# EAGLE design db9umt32 (EAGLE 9.0.0)
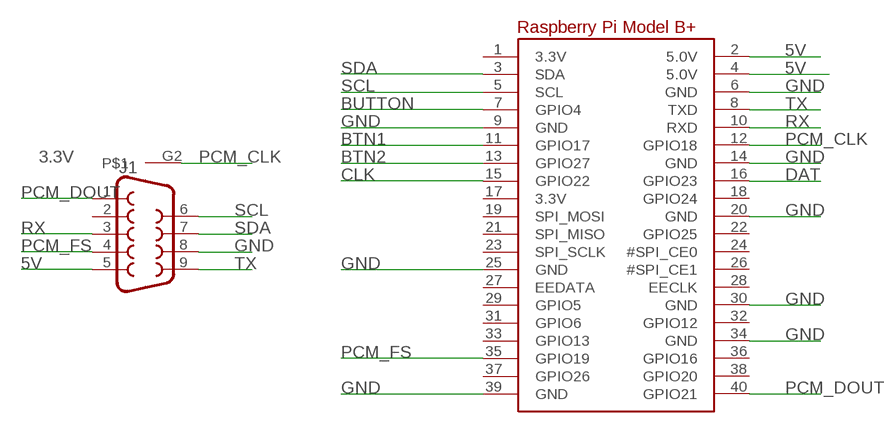
[diagram p0: schematic, sheet 1]

## Parts
J1  SPARKFUN-CONNECTORS_DB9FEMALE  [SPARKFUN-CONNECTORS_DB9]
RPI2  RASPBERRYPI_BPLUS_BONNETNODIM  [PI_BONNET_NODIM]

## Nets
5V: J1.5 RPI2.2(5.0V) RPI2.4(5.0V)
BTN1: RPI2.11(GPIO17)
BTN2: RPI2.13(GPIO27)
BUTTON: RPI2.7(GPIO4)
CLK: RPI2.15(GPIO22)
DAT: RPI2.16(GPIO23)
GND: J1.8 RPI2.6(GND) RPI2.9(GND) RPI2.14(GND) RPI2.20(GND) RPI2.25(GND) RPI2.30(GND) RPI2.34(GND) RPI2.39(GND)
PCM_CLK: J1.G2 RPI2.12(GPIO18)
PCM_DOUT: J1.1 RPI2.40(GPIO21)
PCM_FS: J1.4 RPI2.35(GPIO19)
RX: J1.3 RPI2.10(RXD)
SCL: J1.6 RPI2.5(SCL)
SDA: J1.7 RPI2.3(SDA)
TX: J1.9 RPI2.8(TXD)
Unconnected: J1.2 RPI2.1(3.3V) RPI2.17(3.3V) RPI2.18(GPIO24) RPI2.19(SPI_MOSI) RPI2.21(SPI_MISO) RPI2.22(GPIO25) RPI2.23(SPI_SCLK) RPI2.24(#SPI_CE0) RPI2.26(#SPI_CE1) RPI2.27(EEDATA) RPI2.28(EECLK) RPI2.29(GPIO5) RPI2.31(GPIO6) RPI2.32(GPIO12) RPI2.33(GPIO13) RPI2.36(GPIO16) RPI2.37(GPIO26) RPI2.38(GPIO20)

## Library data of the parts
J1 = db9tg:SPARKFUN-CONNECTORS_DB9: DB9 Connector Standard DB9 (D-Sub 9) serial connector. Can be used for CAN bus as well as RS485 and RS232. Footprint production proven. Here is the female version connector we sell at SparkFun: 9 Pin Female Serial Connector - PCB Mount <https://www.sparkfun.com/products/429> (PRT-00429) This connector has been used on the following SparkFun products: SparkFun RS232 Shifter - SMD <https://www.sparkfun.com/products/449> (PRT-00449) SparkFun RS232 Shifter SMD (No DB9) <https://www.sparkfun.com/products/8780> (PRT-08780); PROD_ID: CONN-08194
RPI2 = microbuilder:RASPBERRYPI_BPLUS

## Net classes
1 GND: width 0.254 mm
2 VCC: width 0.254 mm

## Board
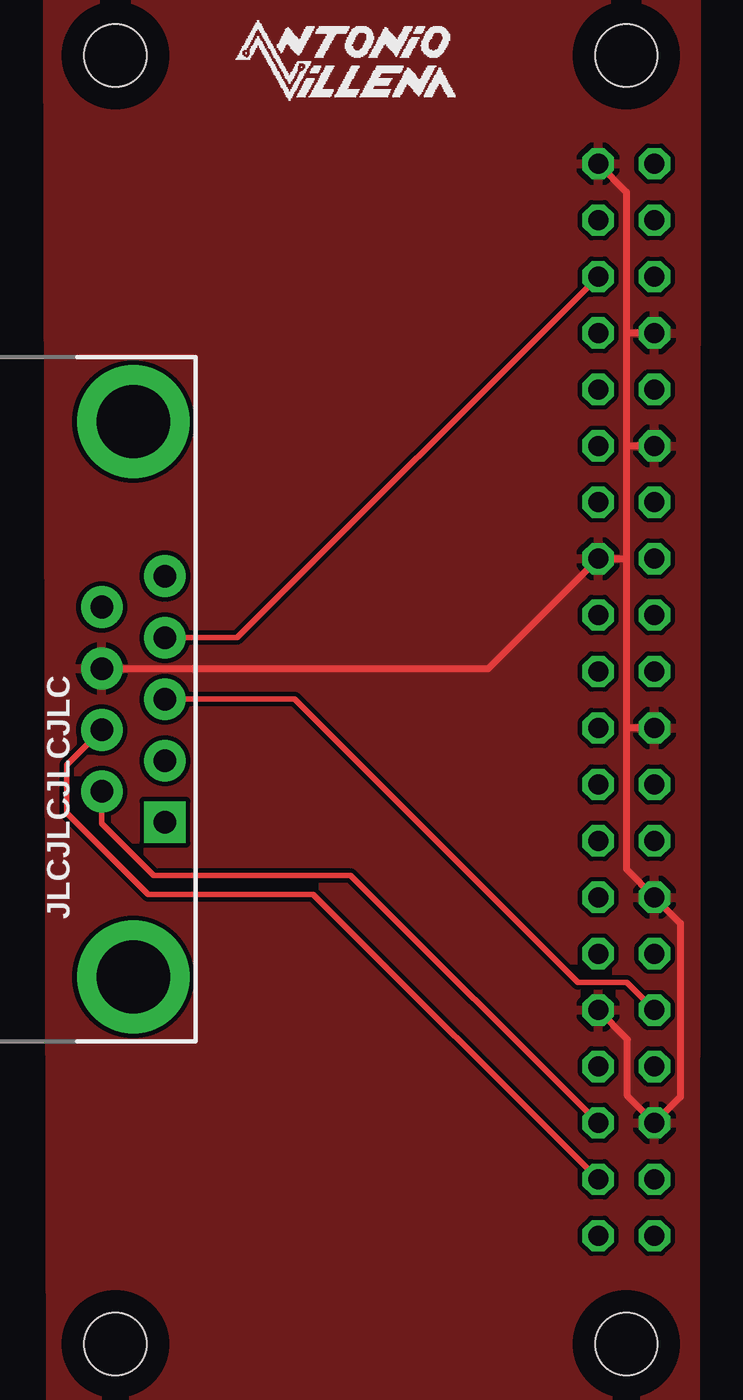
[diagram p1: board, top side]
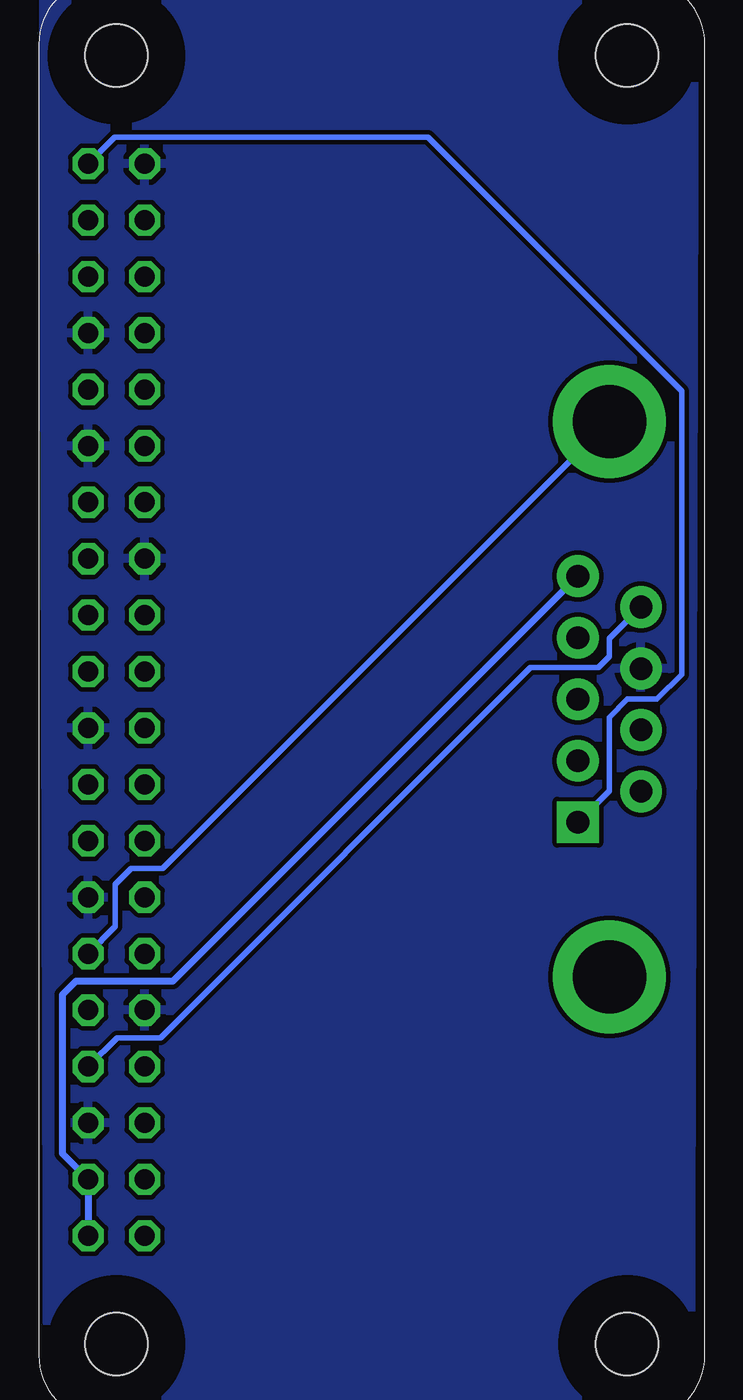
[diagram p2: board, bottom side, seen from below]

No outline drawn. Coordinates in mm, seen from the top.
Copper layers (1*16): Top 0.035mm / dielectric 1.5mm / Bottom 0.035mm
Design rules "default *": minimum track width 10mil, minimum drill 24mil, track to track 8mil, track to pad 8mil, pad to pad 8mil, via to via 8mil, smd to smd 8mil, copper to edge 40mil, drill to drill 8mil, minimum pad ring 10mil, minimum via ring 8mil, stop-mask expansion 4mil, vias tented up to drill 20mil, thermal gap 10mil

### Footprints (pad centres in the part's own frame; a part is rotated, then mirrored left to right if it is on the bottom)
SPARKFUN-CONNECTORS_DB9 = drill 1.016 pad 1.88 square: 1 -5.54,-1.42 | drill 1.016 pad 1.88: 2 -2.77,-1.42; 3 0,-1.42; 4 2.77,-1.42; 5 5.54,-1.42; 6 -4.15,1.42; 7 -1.38,1.42; 8 1.38,1.42; 9 4.15,1.42 | drill 3.302 pad 5.08: G1 -12.5,0; G2 12.5,0
PI_BONNET_NODIM = drill 0.9 octagon: 1 8.37,25.23; 2 8.37,27.77; 3 10.91,25.23; 4 10.91,27.77; 5 13.45,25.23; 6 13.45,27.77; 7 15.99,25.23; 8 15.99,27.77; 9 18.53,25.23; 10 18.53,27.77; 11 21.07,25.23; 12 21.07,27.77; 13 23.61,25.23; 14 23.61,27.77; 15 26.15,25.23; 16 26.15,27.77; 17 28.69,25.23; 18 28.69,27.77; 19 31.23,25.23; 20 31.23,27.77; 21 33.77,25.23; 22 33.77,27.77; 23 36.31,25.23; 24 36.31,27.77; 25 38.85,25.23; 26 38.85,27.77; 27 41.39,25.23; 28 41.39,27.77; 29 43.93,25.23; 30 43.93,27.77; 31 46.47,25.23; 32 46.47,27.77; 33 49.01,25.23; 34 49.01,27.77; 35 51.55,25.23; 36 51.55,27.77; 37 54.09,25.23; 38 54.09,27.77; 39 56.63,25.23; 40 56.63,27.77 | hole 2.8: 3.5,3.5; 3.5,26.5; 61.5,26.5; 61.5,3.5

### Placement (x,y rotation side)
J1  5.49,28.14 90 top
RPI2  1.18,-4.38 90 bottom

### Tracks (layer width: path | path; a pad name or v marks a point on that pad's centre or on a via)
5V
  Bottom 0.305: J1.5 25.15,15.44 29.52,15.44 30.12,14.83 30.12,7.7 RPI2.4 RPI2.2
GND
  Top 0.305: J1.8 21.47,29.52 RPI2.25 27.66,34.47 27.69,34.44 | RPI2.39 27.69,50.98 27.69,44.6 | 27.69,44.6 27.69,39.47 | 27.69,39.47 27.69,34.44 | 27.69,34.44 27.69,26.92 | 27.69,26.92 27.69,20.5 RPI2.14 30.12,18.06 30.12,10.24 RPI2.6 27.74,10.29 27.74,12.83 RPI2.9 | RPI2.34 27.71,44.63 27.69,44.6 | RPI2.30 27.76,39.55 27.69,39.47 | RPI2.20 27.76,26.85 27.69,26.92
  pour Bottom: 1.64,60.25 30.98,60.25 30.8,-3.97 1.82,-4.03
  pour Top: 1.64,60.35 30.83,60.1 30.8,-4.02 1.77,-3.98
PCM_CLK
  Bottom 0.254: J1.G2 25.61,20.52 27.03,20.52 27.74,19.81 27.74,17.91 RPI2.12
PCM_DOUT
  Bottom 0.254: J1.1 5.49,24.02 5.49,27.33 4.67,28.14 3.35,28.14 2.23,29.26 2.23,42.01 13.66,53.44 27.76,53.44 RPI2.40
PCM_FS
  Top 0.254: J1.4 10.16,30.91 RPI2.35
RX
  Top 0.254: J1.3 12.75,28.14 25.5,15.39 27.71,15.39 RPI2.10
SCL
  Top 0.254: J1.6 4.07,22.55 6.4,20.22 15.27,20.22 RPI2.5
SDA
  Top 0.254: J1.7 2.49,25.19 2.49,23.01 6.15,19.36 13.59,19.36 RPI2.3
TX
  Bottom 0.254: J1.9 5.49,30.87 5.49,30.07 5.99,29.57 9.04,29.57 25.7,12.9 27.66,12.9 RPI2.8

### Text on the board
tPlace: JLCJLCJLCJLC